# Altium schematic sheet WheelLED_Light_Sch.SchDoc: WheelLED-Light
size 152 x 152 mm; Author: Hom; CompanyName: KitSprout; DrawnBy: Hom; Engineer: Hom; Organization: KitSprout; Revision: A; SheetNumber: 1; SheetTotal: 1; License: CC BY-SA 4.0; Version: 2.0; LibVersion: 1.4; PageSetup: Record=PageOptions|CenterHorizontal=True|CenterVertical=True|PrintScale=0.65|XCorrection=1.00|YCorrection=1.00|PrintKind=0|BorderSize=5000000|LeftOffset=0|BottomOffset=0|Orientation=2|PaperLength=1000|PaperWidth=1000|Scale=100|PaperSource=7|PrintQuality=-3|MediaType=1|DitherType=10|PrintScaleMode=1|PaperKind=A4|PaperIndex=9
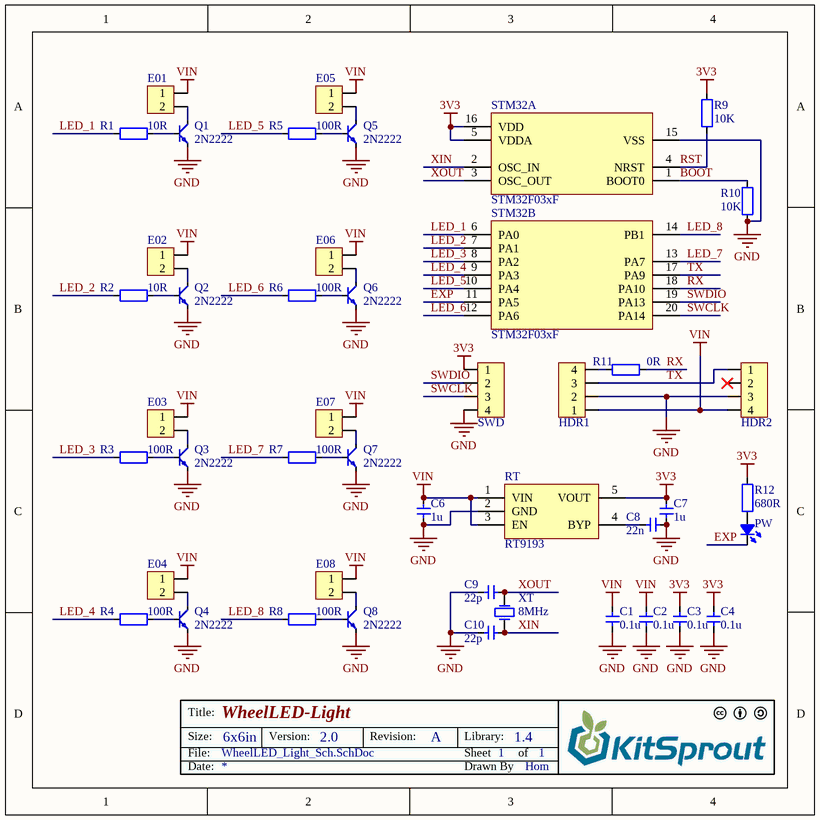
[diagram p0: WheelLED_Light_Sch.SchDoc]

## Parts
C1  value 0.1u  [CAP_0603]  (hidden comment: Cap_0603)
C2  value 0.1u  [CAP_0603]  (hidden comment: Cap_0603)
C3  value 0.1u  [CAP_0603]  (hidden comment: Cap_0603)
C4  value 0.1u  [CAP_0603]  (hidden comment: Cap_0603)
C6  value 1u  [CAP_0603]  (hidden comment: Cap_0603)
C7  value 1u  [CAP_0603]  (hidden comment: Cap_0603)
C8  value 22n  [CAP_0603]  (hidden comment: Cap_0603)
C9  value 22p  [CAP_0603]  (hidden comment: Cap_0603)
C10  value 22p  [CAP_0603]  (hidden comment: Cap_0603)
E01  HDR1x2_2.54  [HDR1X2_2.54_180H]  (value not drawn)
E02  HDR1x2_2.54  [HDR1X2_2.54_180H]  (value not drawn)
E03  HDR1x2_2.54  [HDR1X2_2.54_180H]  (value not drawn)
E04  HDR1x2_2.54  [HDR1X2_2.54_180H]  (value not drawn)
E05  HDR1x2_2.54  [HDR1X2_2.54_180H]  (value not drawn)
E06  HDR1x2_2.54  [HDR1X2_2.54_180H]  (value not drawn)
E07  HDR1x2_2.54  [HDR1X2_2.54_180H]  (value not drawn)
E08  HDR1x2_2.54  [HDR1X2_2.54_180H]  (value not drawn)
HDR1  HDR1x4_2.54  [HDR1X4_2.54_90F]  (value not drawn)
HDR2  HDR1x4_2.54  [HDR1X4_2.54_180H]  (value not drawn)
PW  LED_0805  [LED_0805_GREEN]  (value not drawn)
Q1  value 2N2222  [SOT23-3]  (hidden comment: BJT_NPN)
Q2  value 2N2222  [SOT23-3]  (hidden comment: BJT_NPN)
Q3  value 2N2222  [SOT23-3]  (hidden comment: BJT_NPN)
Q4  value 2N2222  [SOT23-3]  (hidden comment: BJT_NPN)
Q5  value 2N2222  [SOT23-3]  (hidden comment: BJT_NPN)
Q6  value 2N2222  [SOT23-3]  (hidden comment: BJT_NPN)
Q7  value 2N2222  [SOT23-3]  (hidden comment: BJT_NPN)
Q8  value 2N2222  [SOT23-3]  (hidden comment: BJT_NPN)
R1  value 10R  [RES_0603]  (hidden comment: Res_0603)
R2  value 10R  [RES_0603]  (hidden comment: Res_0603)
R3  value 100R  [RES_0603]  (hidden comment: Res_0603)
R4  value 100R  [RES_0603]  (hidden comment: Res_0603)
R5  value 100R  [RES_0603]  (hidden comment: Res_0603)
R6  value 100R  [RES_0603]  (hidden comment: Res_0603)
R7  value 100R  [RES_0603]  (hidden comment: Res_0603)
R8  value 100R  [RES_0603]  (hidden comment: Res_0603)
R9  value 10K  [RES_0603]  (hidden comment: Res_0603)
R10  value 10K  [RES_0603]  (hidden comment: Res_0603)
R11  value 0R  [RES_0603]  (hidden comment: Res_0603)
R12  value 680R  [RES_0805]  (hidden comment: Res_0805)
RT  RT9193  [SOT23-5]
STM32  STM32F03xF  [TSSOP_E170_P0.65_20]  (parts A,B of 2)
SWD  HDR1x4_1.27  [HDR1X4_1.27_180]  (value not drawn)
XT  value 8MHz  [XT_3225_2]  (hidden comment: XTAL_3225_2P)

## Nets
3V3: C3.2 C4.2 C7.2 R9.1 R12.2 RT.5(VOUT) STM32.5(VDDA) STM32.16(VDD) SWD.1
GND: C1.1 C2.1 C3.1 C4.1 C6.1 C7.1 C8.1 C9.2 C10.2 HDR1.2 HDR2.3 Q1.2(E) Q2.2(E) Q3.2(E) Q4.2(E) Q5.2(E) Q6.2(E) Q7.2(E) Q8.2(E) R10.2 RT.2(GND) STM32.15(VSS) SWD.4
VIN: C1.2 C2.2 C6.2 E01.1 E02.1 E03.1 E04.1 E05.1 E06.1 E07.1 E08.1 HDR1.1 HDR2.4 RT.1(VIN) RT.3(EN)
BOOT: R10.1 STM32.1(BOOT0)
EXP: PW.2(K) STM32.11(PA5)
LED_1: R1.1 STM32.6(PA0)
LED_2: R2.1 STM32.7(PA1)
LED_3: R3.1 STM32.8(PA2)
LED_4: R4.1 STM32.9(PA3)
LED_5: R5.1 STM32.10(PA4)
LED_6: R6.1 STM32.12(PA6)
LED_7: R7.1 STM32.13(PA7)
LED_8: R8.1 STM32.14(PB1)
RST: R9.2 STM32.4(NRST)
RX: R11.2 STM32.18(PA10)
SWCLK: STM32.20(PA14) SWD.3
SWDIO: STM32.19(PA13) SWD.2
TX: HDR1.3 HDR2.1 STM32.17(PA9)
XIN: C10.1 STM32.2(OSC_IN) XT.1(OSC1)
XOUT: C9.1 STM32.3(OSC_OUT) XT.2(OSC2)
NetC8_2: C8.2 RT.4(BYP)
NetE01_2: E01.2 Q1.3(C)
NetE02_2: E02.2 Q2.3(C)
NetE03_2: E03.2 Q3.3(C)
NetE04_2: E04.2 Q4.3(C)
NetE05_2: E05.2 Q5.3(C)
NetE06_2: E06.2 Q6.3(C)
NetE07_2: E07.2 Q7.3(C)
NetE08_2: E08.2 Q8.3(C)
NetHDR1_4: HDR1.4 R11.1
NetPW_1: PW.1(A) R12.1
NetQ1_1: Q1.1(B) R1.2
NetQ2_1: Q2.1(B) R2.2
NetQ3_1: Q3.1(B) R3.2
NetQ4_1: Q4.1(B) R4.2
NetQ5_1: Q5.1(B) R5.2
NetQ6_1: Q6.1(B) R6.2
NetQ7_1: Q7.1(B) R7.2
NetQ8_1: Q8.1(B) R8.2

Not connected (* = marked no-connect by the designer): HDR2 2*

## Notes on the sheet
- Title:
- Size:
- Date:
- File:
- 6x6in
- Version:
- Revision:
- Sheet
- Drawn By
- Library:
- of

## Library data of the parts
C1-C4 C6-C10 = Cap_0603: Capacitor
E01 E02 E03 E04 E05 E06 E07 E08 = HDR1x2_2.54T: Header
HDR1 HDR2 = HDR1x4_2.54: Header
PW = LED_0805: LED
Q1-Q8 = BJT_NPN: Transistor
R1-R11 = Res_0603: Resistor
R12 = Res_0805: Resistor
RT = RT9193: Power
STM32 = STM32F03xF: MCU
SWD = HDR1x4_1.27: Header
XT = XTAL_3225_2P: Crystal Oscillator